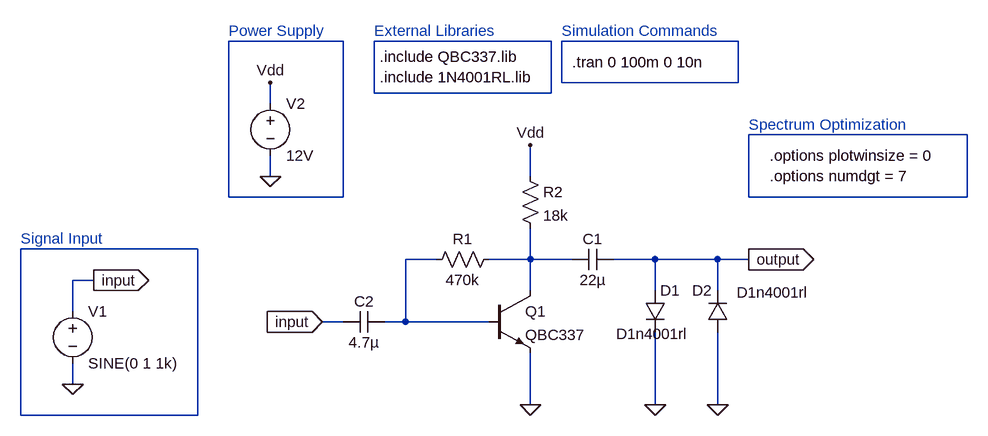
[diagram p0: schematic simple_distortion_circuit.asc]
simple_distortion_circuit.asc, the LTspice schematic file:
Version 4
SHEET 1 976 680
WIRE -912 -352 -1088 -352
WIRE -592 -352 -864 -352
WIRE -304 -352 -576 -352
WIRE -576 -288 -576 -352
WIRE -304 -288 -304 -352
WIRE -304 -288 -576 -288
WIRE -864 -272 -864 -352
WIRE -592 -272 -592 -352
WIRE -592 -272 -864 -272
WIRE -1024 -256 -1024 -288
WIRE 48 -208 -288 -208
WIRE -1024 -144 -1024 -176
WIRE -624 -144 -624 -192
WIRE -1088 -112 -1088 -352
WIRE -912 -112 -912 -352
WIRE -912 -112 -1088 -112
WIRE -288 -112 -288 -208
WIRE 48 -112 48 -208
WIRE 48 -112 -288 -112
WIRE -1136 -32 -1408 -32
WIRE -768 -16 -816 -16
WIRE -624 -16 -624 -64
WIRE -624 -16 -688 -16
WIRE -560 -16 -624 -16
WIRE -432 -16 -496 -16
WIRE -336 -16 -432 -16
WIRE -288 -16 -336 -16
WIRE -1296 16 -1328 16
WIRE -624 32 -624 -16
WIRE -432 32 -432 -16
WIRE -336 32 -336 -16
WIRE -1328 64 -1328 16
WIRE -912 80 -944 80
WIRE -816 80 -816 -16
WIRE -816 80 -848 80
WIRE -688 80 -816 80
WIRE -1328 176 -1328 144
WIRE -624 208 -624 128
WIRE -432 208 -432 96
WIRE -336 208 -336 96
WIRE -1408 224 -1408 -32
WIRE -1136 224 -1136 -32
WIRE -1136 224 -1408 224
FLAG -1328 176 0
FLAG -1296 16 input
IOPIN -1296 16 Out
FLAG -624 208 0
FLAG -432 208 0
FLAG -336 208 0
FLAG -1024 -144 0
FLAG -1024 -288 Vdd
FLAG -624 -192 Vdd
FLAG -944 80 input
IOPIN -944 80 In
FLAG -288 -16 output
IOPIN -288 -16 Out
SYMBOL voltage -1328 48 R0
WINDOW 123 0 0 Left 0
WINDOW 39 0 0 Left 0
SYMATTR InstName V1
SYMATTR Value SINE(0 1 1k)
SYMBOL npn -688 32 R0
SYMATTR InstName Q1
SYMATTR Value QBC337
SYMBOL res -672 -32 R90
WINDOW 0 0 56 VBottom 2
WINDOW 3 32 56 VTop 2
SYMATTR InstName R1
SYMATTR Value 470k
SYMBOL res -640 -160 R0
SYMATTR InstName R2
SYMATTR Value 18k
SYMBOL cap -496 -32 R90
WINDOW 0 0 32 VBottom 2
WINDOW 3 32 32 VTop 2
SYMATTR InstName C1
SYMATTR Value 22µ
SYMBOL diode -448 32 R0
WINDOW 3 -44 67 Left 2
SYMATTR InstName D1
SYMATTR Value D1n4001rl
SYMBOL diode -320 96 R180
WINDOW 0 24 64 Left 2
WINDOW 3 -125 61 Left 2
SYMATTR InstName D2
SYMATTR Value D1n4001rl
SYMBOL cap -848 64 R90
WINDOW 0 0 32 VBottom 2
WINDOW 3 32 32 VTop 2
SYMATTR InstName C2
SYMATTR Value 4.7µ
SYMBOL voltage -1024 -272 R0
SYMATTR InstName V2
SYMATTR Value 12V
TEXT -256 -176 Left 2 !.options plotwinsize = 0\n.options numdgt = 7
TEXT -288 -224 Left 2 ;Spectrum Optimization
TEXT -560 -320 Left 2 !.tran 0 100m 0 10n
TEXT -576 -368 Left 2 ;Simulation Commands
TEXT -856 -328 Left 2 !.include QBC337.lib\n.include 1N4001RL.lib
TEXT -864 -368 Left 2 ;External Libraries
TEXT -1088 -368 Left 2 ;Power Supply
TEXT -1408 -48 Left 2 ;Signal Input

The netlist it stands for:
* simple_distortion_circuit.asc
V1 input 0 SINE(0 1 1k)
Q1 N007 N006 0 0 QBC337
R1 N007 N006 470k
R2 Vdd N007 18k
C1 output N007 22µ
D1 output 0 D1n4001rl
D2 0 output D1n4001rl
C2 N006 input 4.7µ
V2 Vdd 0 12V
.model D D
.lib standard.dio
.model NPN NPN
.model PNP PNP
.lib standard.bjt
.options plotwinsize = 0
.options numdgt = 7
* Spectrum Optimization
.tran 0 100m 0 10n
* Simulation Commands
.include QBC337.lib
.include 1N4001RL.lib
* External Libraries
* Power Supply
* Signal Input
.backanno
.end